# Altium schematic sheet Encoder.SchDoc
size A4; SheetNumber: 2; SheetTotal: 5
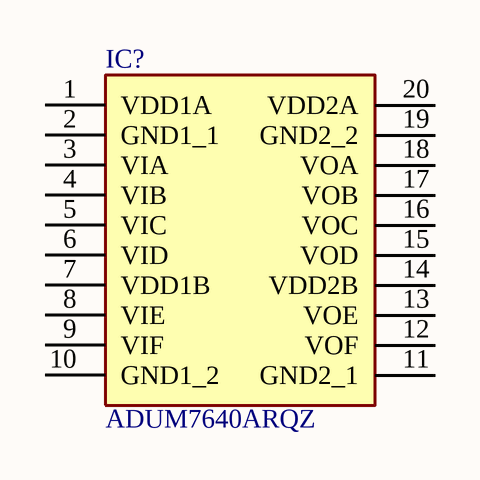
[diagram p0: Encoder.SchDoc]

## Parts
IC?  ADUM7640ARQZ  [SOP64P600X175-20N]

## Nets

Not connected (* = marked no-connect by the designer): IC? 1(VDD1A) 2(GND1_1) 3(VIA) 4(VIB) 5(VIC) 6(VID) 7(VDD1B) 8(VIE) 9(VIF) 10(GND1_2) 11(GND2_1) 12(VOF) 13(VOE) 14(VDD2B) 15(VOD) 16(VOC) 17(VOB) 18(VOA) 19(GND2_2) 20(VDD2A)

## Library data of the parts
IC? = ADUM7640ARQZ: Integrated Circuit; Manufacturer_Name: Analog Devices; Datasheet Link: http://www.analog.com/media/en/technical-documentation/data-sheets/ADuM7640_7641_7642_7643.pdf; Height: 1.75mm; Manufacturer_Part_Number: ADUM7640ARQZ; Mouser Part Number: 584-ADUM7640ARQZ; Mouser Price/Stock: https://www.mouser.co.uk/ProductDetail/Analog-Devices/ADUM7640ARQZ?qs=WIvQP4zGanjBvVF9gfAxZw%3D%3D; Arrow Part Number: ADUM7640ARQZ; Arrow Price/Stock: https://www.arrow.com/en/products/adum7640arqz/analog-devices